# EAGLE design Ver.5 IR (EAGLE 9.6.2)
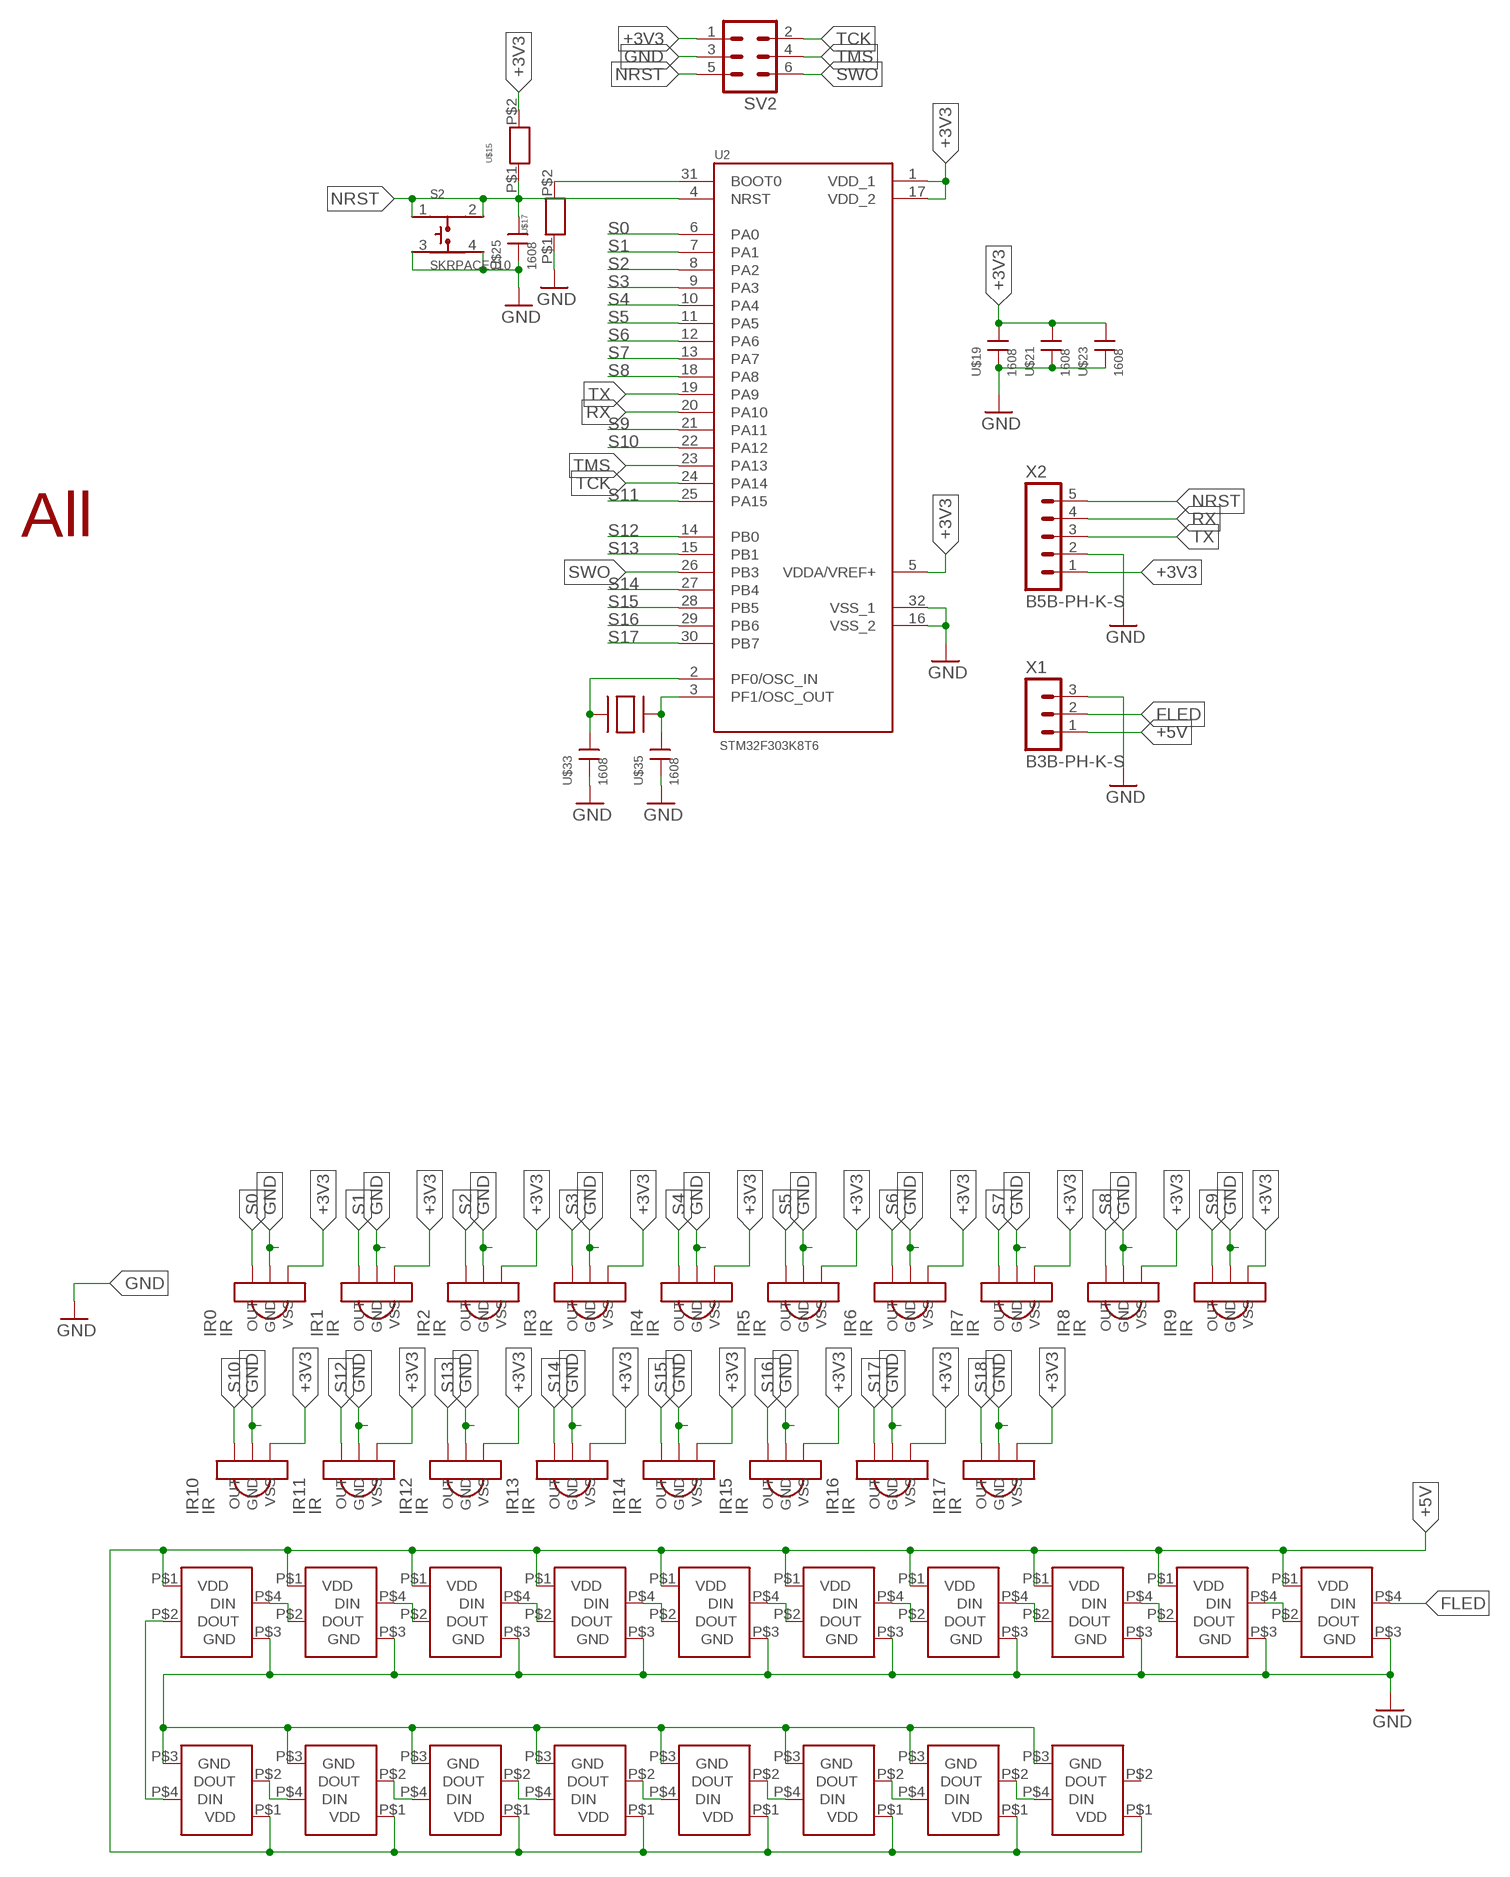
[diagram p0: schematic, sheet 1]

## Parts
F0  LED  [LED]
F1  LED  [LED]
F2  LED  [LED]
F3  LED  [LED]
F4  LED  [LED]
F5  LED  [LED]
F6  LED  [LED]
F7  LED  [LED]
F8  LED  [LED]
F9  LED  [LED]
F10  LED  [LED]
F11  LED  [LED]
F12  LED  [LED]
F13  LED  [LED]
F14  LED  [LED]
F15  LED  [LED]
F16  LED  [LED]
F17  LED  [LED]
IR0  IR  [IR]
IR1  IR  [IR]
IR2  IR  [IR]
IR3  IR  [IR]
IR4  IR  [IR]
IR5  IR  [IR]
IR6  IR  [IR]
IR7  IR  [IR]
IR8  IR  [IR]
IR9  IR  [IR]
IR10  IR  [IR]
IR11  IR  [IR]
IR12  IR  [IR]
IR13  IR  [IR]
IR14  IR  [IR]
IR15  IR  [IR]
IR16  IR  [IR]
IR17  IR  [IR]
S2  SKRPACE010  [SW_SKRPACE010]
SV2  ML6  [ML6]
U2  STM32F303K8T6  [QFP80P900X900X160-32N]
U$1  ALL  [ALL]
U$15  R  [1608]
U$17  R  [1608]
U$19  1608  [CON]
U$21  1608  [CON]
U$23  1608  [CON]
U$25  1608  [CON]
U$27  SUISYOU  [水晶]
U$33  1608  [CON]
U$35  1608  [CON]
X1  B3B-PH-K-S  [B3B-PH-K-S]
X2  B5B-PH-K-S  [B5B-PH-K-S]

## Nets
+3V3 [New Class]: IR0.P$3(VSS) IR1.P$3(VSS) IR2.P$3(VSS) IR3.P$3(VSS) IR4.P$3(VSS) IR5.P$3(VSS) IR6.P$3(VSS) IR7.P$3(VSS) IR8.P$3(VSS) IR9.P$3(VSS) IR10.P$3(VSS) IR11.P$3(VSS) IR12.P$3(VSS) IR13.P$3(VSS) IR14.P$3(VSS) IR15.P$3(VSS) IR16.P$3(VSS) IR17.P$3(VSS) SV2.1 U2.1(VDD_1) U2.5(VDDA/VREF+) U2.17(VDD_2) U$15.P$2 U$19.P$1 U$21.P$1 U$23.P$1 X2.1
+5V [New Class]: F0.P$1(VDD) F1.P$1(VDD) F2.P$1(VDD) F3.P$1(VDD) F4.P$1(VDD) F5.P$1(VDD) F6.P$1(VDD) F7.P$1(VDD) F8.P$1(VDD) F9.P$1(VDD) F10.P$1(VDD) F11.P$1(VDD) F12.P$1(VDD) F13.P$1(VDD) F14.P$1(VDD) F15.P$1(VDD) F16.P$1(VDD) F17.P$1(VDD) X1.1
FLED: F0.P$4(DIN) X1.2
GND [New Class]: F0.P$3(GND) F1.P$3(GND) F2.P$3(GND) F3.P$3(GND) F4.P$3(GND) F5.P$3(GND) F6.P$3(GND) F7.P$3(GND) F8.P$3(GND) F9.P$3(GND) F10.P$3(GND) F11.P$3(GND) F12.P$3(GND) F13.P$3(GND) F14.P$3(GND) F15.P$3(GND) F16.P$3(GND) F17.P$3(GND) IR0.P$2(GND) IR1.P$2(GND) IR2.P$2(GND) IR3.P$2(GND) IR4.P$2(GND) IR5.P$2(GND) IR6.P$2(GND) IR7.P$2(GND) IR8.P$2(GND) IR9.P$2(GND) IR10.P$2(GND) IR11.P$2(GND) IR12.P$2(GND) IR13.P$2(GND) IR14.P$2(GND) IR15.P$2(GND) IR16.P$2(GND) IR17.P$2(GND) S2.3 S2.4 SV2.3 U2.16(VSS_2) U2.32(VSS_1) U$17.P$1 U$19.P$2 U$21.P$2 U$23.P$2 U$25.P$2 U$33.P$2 U$35.P$2 X1.3 X2.2
N$1: F14.P$2(DOUT) F15.P$4(DIN)
N$2: F13.P$2(DOUT) F14.P$4(DIN)
N$3: F11.P$2(DOUT) F12.P$4(DIN)
N$4: F10.P$2(DOUT) F11.P$4(DIN)
N$5: F8.P$2(DOUT) F9.P$4(DIN)
N$6: F7.P$2(DOUT) F8.P$4(DIN)
N$7: F5.P$2(DOUT) F6.P$4(DIN)
N$8: F4.P$2(DOUT) F5.P$4(DIN)
N$9: F2.P$2(DOUT) F3.P$4(DIN)
N$10: F1.P$2(DOUT) F2.P$4(DIN)
N$11: F0.P$2(DOUT) F1.P$4(DIN)
N$12: F3.P$2(DOUT) F4.P$4(DIN)
N$13: F6.P$2(DOUT) F7.P$4(DIN)
N$14: F9.P$2(DOUT) F10.P$4(DIN)
N$15: F16.P$2(DOUT) F17.P$4(DIN)
N$17: F15.P$2(DOUT) F16.P$4(DIN)
N$18: F12.P$2(DOUT) F13.P$4(DIN)
N$38: U2.31(BOOT0) U$17.P$2
N$39: U2.2(PF0/OSC_IN) U$27.P$1 U$33.P$1
N$40: U2.3(PF1/OSC_OUT) U$27.P$2 U$35.P$1
NRST: S2.1 S2.2 SV2.5 U2.4(NRST) U$15.P$1 U$25.P$1 X2.5
RX: U2.20(PA10) X2.4
S0: IR0.P$1(OUT) U2.6(PA0)
S1: IR1.P$1(OUT) U2.7(PA1)
S2: IR2.P$1(OUT) U2.8(PA2)
S3: IR3.P$1(OUT) U2.9(PA3)
S4: IR4.P$1(OUT) U2.10(PA4)
S5: IR5.P$1(OUT) U2.11(PA5)
S6: IR6.P$1(OUT) U2.12(PA6)
S7: IR7.P$1(OUT) U2.13(PA7)
S8: IR8.P$1(OUT) U2.18(PA8)
S9: IR9.P$1(OUT) U2.21(PA11)
S10: IR10.P$1(OUT) U2.22(PA12)
S11: U2.25(PA15)
S12: IR11.P$1(OUT) U2.14(PB0)
S13: IR12.P$1(OUT) U2.15(PB1)
S14: IR13.P$1(OUT) U2.27(PB4)
S15: IR14.P$1(OUT) U2.28(PB5)
S16: IR15.P$1(OUT) U2.29(PB6)
S17: IR16.P$1(OUT) U2.30(PB7)
S18: IR17.P$1(OUT)
SWO: SV2.6 U2.26(PB3)
TCK: SV2.2 U2.24(PA14)
TMS: SV2.4 U2.23(PA13)
TX: U2.19(PA9) X2.3
Unconnected: F17.P$2(DOUT)

## Library data of the parts
F0 F1-F17 = フルカラーLED:LED
IR0 IR1-IR17 = IR:IR
S2 = SKRPACE010:SKRPACE010: Switch Tactile N.O. SPST Button J-Bend 0.05A 16VDC 2.55N SMD Automotive T/R Check prices <https://pricing.snapeda.com/parts/SKRPACE010/ALPS/view-part?ref=eda>; AVAILABILITY: In Stock; DESCRIPTION: Switch Tactile N.O. SPST Button J-Bend 0.05A 16VDC 2.55N SMD Automotive T/R; MF: ALPS; MP: SKRPACE010; PACKAGE: None; PRICE: None
SV2 = con-ml:ML6: HARTING; OC_FARNELL: unknown; OC_NEWARK: unknown
U2 = STM32F303K8T6:STM32F303K8T6: Analog and DSP with FPU ARM Cortex-M4 MCU with 64 Kbytes Flash, 72 MHz CPU, CCM, 12-bit ADC 5 MSPS, comparators, op-amp Check availability <https://pricing.snapeda.com/parts/STM32F303K8T6/STMicroelectronics/view-part?ref=eda>; AVAILABILITY: In Stock; DESCRIPTION: ARM® Cortex®-M4 STM32F3 Microcontroller IC 32-Bit 72MHz 64KB (64K x 8) FLASH 32-LQFP (7x7); MF: STMicroelectronics; MP: STM32F303K8T6; PACKAGE: LQFP-32 STMicroelectronics; PRICE: None; PURCHASE-URL: https://pricing.snapeda.com/search/part/STM32F303K8T6/?ref=eda
U$1 = All_outlook:ALL
U$15 U$17 = R 1608:R
U$19 U$21 U$23 U$25 U$33 U$35 = con1608:1608
U$27 = 水晶:SUISYOU
X1 = con-JST PH:B3B-PH: JST PH series header 2.00mm pitch disconnectable crimp style connectors, vertical (side entry type), 3 pins
X2 = con-JST PH:B5B-PH: JST PH series header 2.00mm pitch disconnectable crimp style connectors, vertical (side entry type), 5 pins

## Net classes
1 New Class: width 0.254 mm

## Board
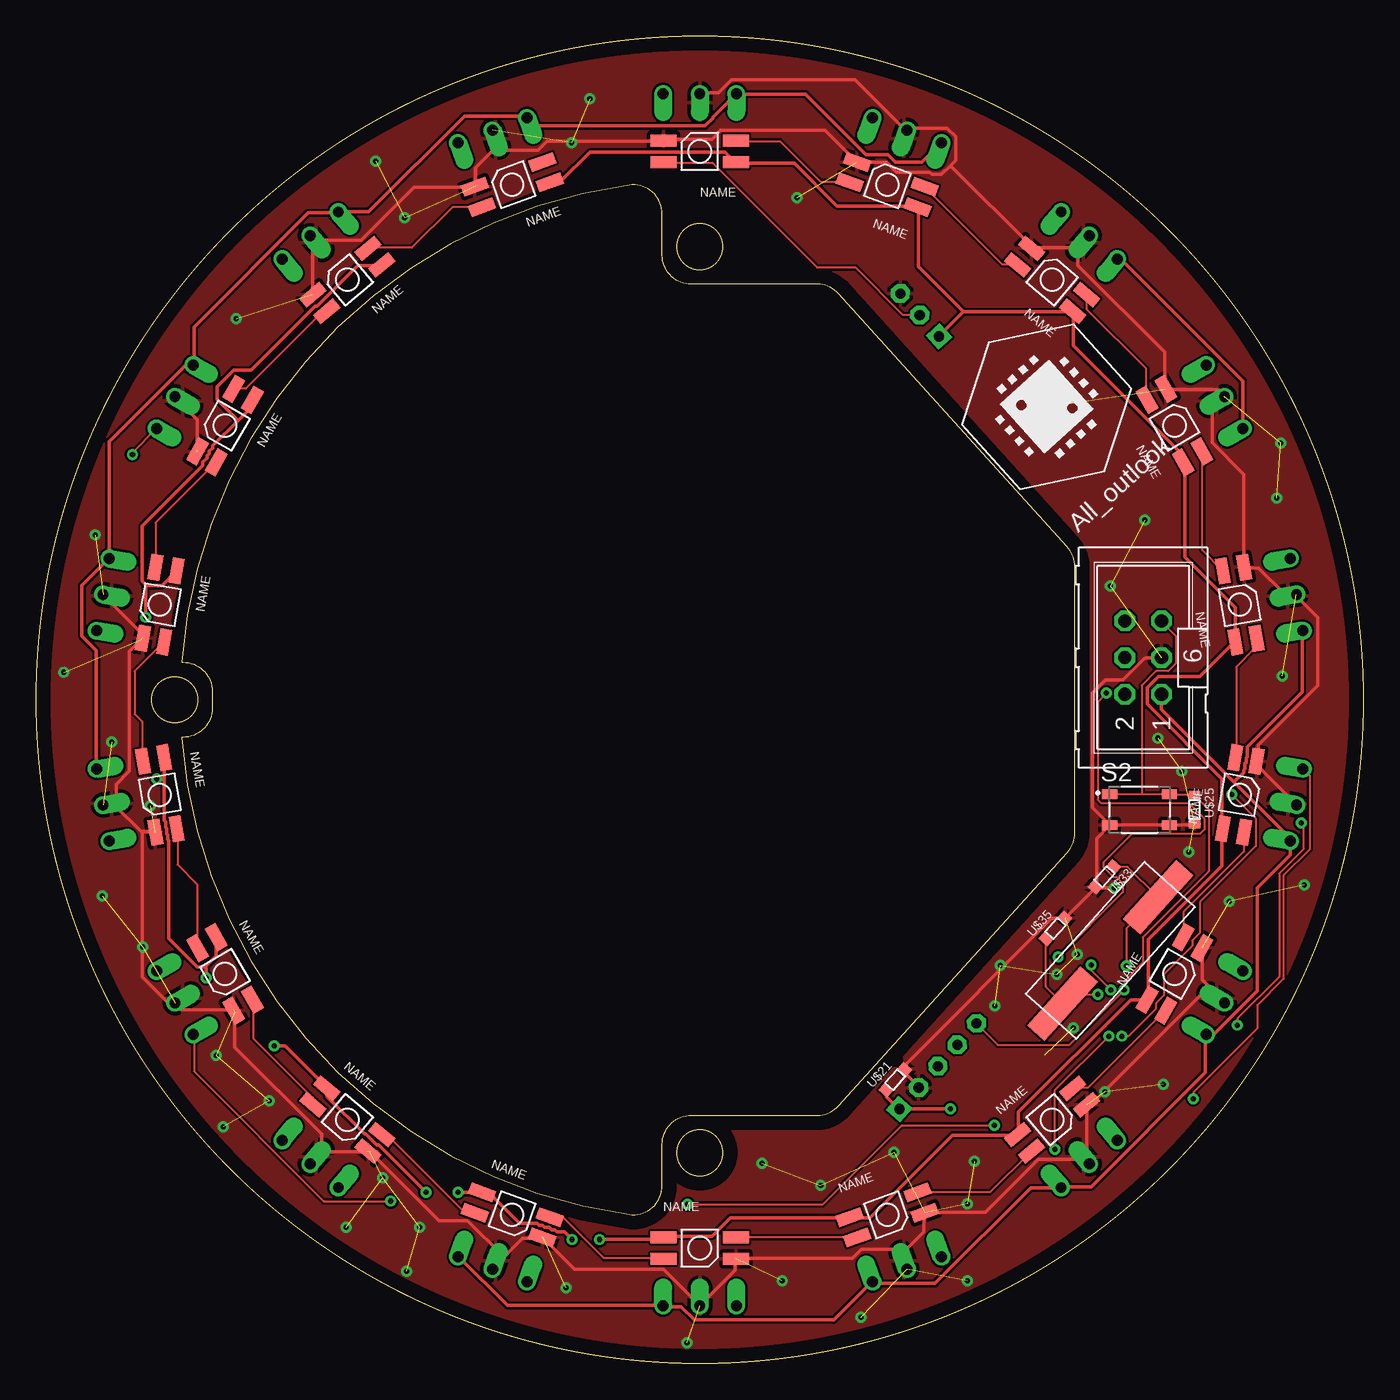
[diagram p1: board, top side]
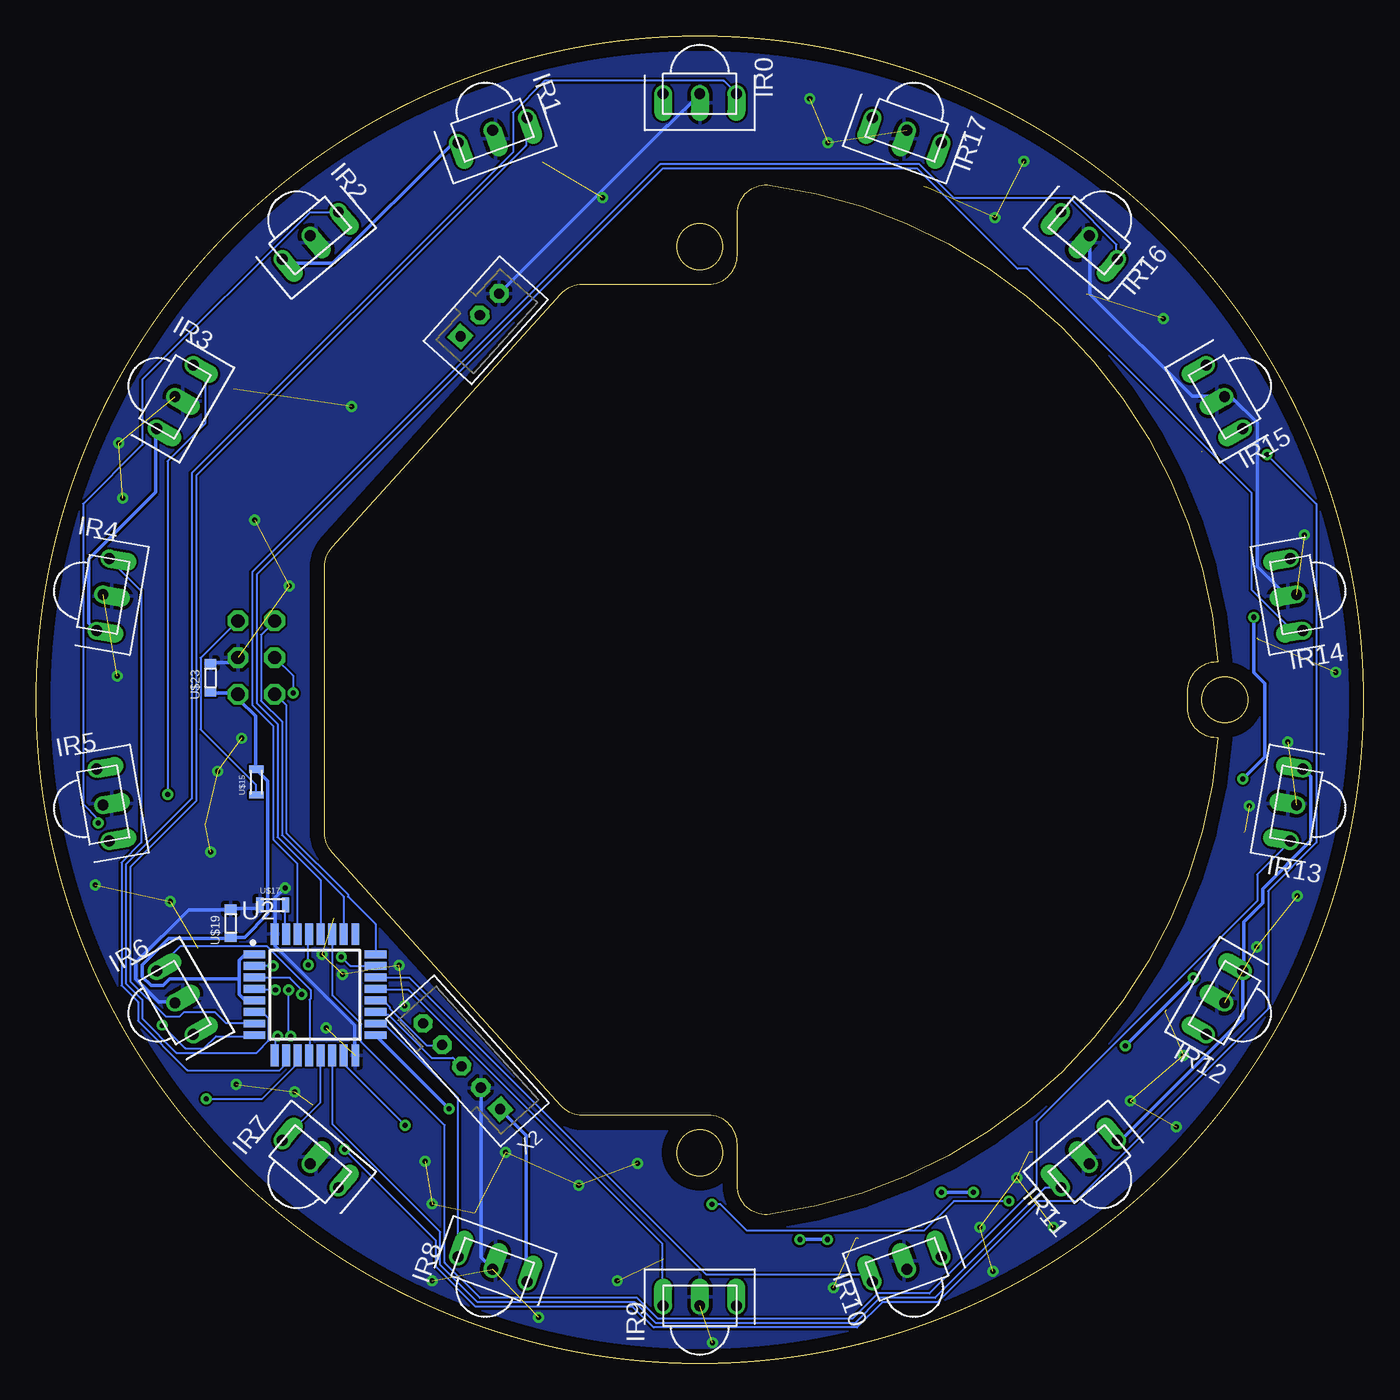
[diagram p2: board, bottom side, seen from below]

Size 92 x 92 mm. Coordinates in mm from the lower left corner, seen from the top.
Outline: 55.61,17.86 71.48,35.42 arc42 72,36.76 72,55.24 arc42 71.48,56.58 55.61,74.14 arc48 54.13,74.8 45.4,74.8 arc-90 43.4,76.8 43.4,79.69 arc98 41.13,81.67 arc78 10.1,48.63 arc94 10.13,48.6 10.2,48.6 arc-90 12.2,46.6 12.2,45.4 arc-90 10.2,43.4 10.15,43.4 arc94 10.1,43.35 arc78 41.13,10.33 arc98 43.4,12.31 43.4,15.2 arc-90 45.4,17.2 54.13,17.2 arc48 55.61,17.86
Outline: circle at 46,14.6 radius 1.6
Outline: circle at 46,77.4 radius 1.6
Outline: circle at 46,46 radius 46
Outline: circle at 9.6,46 radius 1.6
Copper layers (1*16): Top 0.035mm / dielectric 1.5mm / Bottom 0.035mm
Design rules "default": minimum track width 6mil, minimum drill 0.35mm, track to track 6mil, track to pad 6mil, pad to pad 6mil, via to via 6mil, smd to smd 6mil, copper to edge 40mil, drill to drill 6mil, minimum pad ring 10mil, minimum via ring 8mil, stop-mask expansion 4mil, vias tented up to drill 0mil, thermal gap 10mil

### Footprints (pad centres in the part's own frame; a part is rotated, then mirrored left to right if it is on the bottom)
LED = smd 1.8 x 0.82: P$1 -2.5,0.75; P$2 -2.5,-0.75; P$3 2.5,-0.75; P$4 2.5,0.75
IR = drill 0.75 offset: P$1 -2.54,0; P$2 0,0; P$3 2.54,0
SW_SKRPACE010 = smd 1.05 x 0.65: 1 -2.075,1.075; 2 2.075,1.075; 3 -2.075,-1.075; 4 2.075,-1.075
ML6 = drill 0.914 octagon: 1 -2.54,-1.27; 2 -2.54,1.27; 3 0,-1.27; 4 0,1.27; 5 2.54,-1.27; 6 2.54,1.27
QFP80P900X900X160-32N = smd 1.5 x 0.55: 1 -4.2,2.8; 2 -4.2,2; 3 -4.2,1.2; 4 -4.2,0.4; 5 -4.2,-0.4; 6 -4.2,-1.2; 7 -4.2,-2; 8 -4.2,-2.8; 17 4.2,-2.8; 18 4.2,-2; 19 4.2,-1.2; 20 4.2,-0.4; 21 4.2,0.4; 22 4.2,1.2; 23 4.2,2; 24 4.2,2.8 | smd 0.55 x 1.5: 9 -2.8,-4.2; 10 -2,-4.2; 11 -1.2,-4.2; 12 -0.4,-4.2; 13 0.4,-4.2; 14 1.2,-4.2; 15 2,-4.2; 16 2.8,-4.2; 25 2.8,4.2; 26 2,4.2; 27 1.2,4.2; 28 0.4,4.2; 29 -0.4,4.2; 30 -1.2,4.2; 31 -2,4.2; 32 -2.8,4.2
1608 = smd 0.508 x 1.016: P$1 -0.889,0; P$2 0.889,0
CON = smd 0.6 x 0.813: P$1 -1,0; P$2 1,0
水晶 = smd 5.5 x 1.6: P$1 1.2,2.35; P$2 11.1,2.35
B3B-PH-K-S = drill 0.7 pad 1.3 square: 1 2,0 | drill 0.7 pad 1.3 octagon: 2 0,0; 3 -2,0
B5B-PH-K-S = drill 0.7 pad 1.3 square: 1 4,0 | drill 0.7 pad 1.3 octagon: 2 2,0; 3 0,0; 4 -2,0; 5 -4,0

### Placement (x,y rotation side)
F0  46,84 180 top
F1  59,81.71 160 top
F2  70.42,75.11 140 top
F3  78.91,65 120 top
F4  83.42,52.6 100 top
F5  83.42,39.4 80 top
F6  78.91,27 60 top
F7  70.42,16.89 40 top
F8  59,10.29 20 top
F9  46,8 0 top
F10  33,10.29 340 top
F11  21.57,16.89 320 top
F12  13.09,27 300 top
F13  8.58,39.4 280 top
F14  8.58,52.6 260 top
F15  13.09,65 240 top
F16  21.57,75.11 220 top
F17  33,81.71 200 top
IR0  46,88 180 bottom
IR1  60.36,85.47 200 bottom
IR2  73,78.17 220 bottom
IR3  82.37,67 240 bottom
IR4  87.36,53.29 260 bottom
IR5  87.36,38.71 280 bottom
IR6  82.37,25 300 bottom
IR7  73,13.83 320 bottom
IR8  60.36,6.53 340 bottom
IR9  46,4 0 bottom
IR10  31.64,6.53 20 bottom
IR11  19,13.83 40 bottom
IR12  9.63,25 60 bottom
IR13  4.64,38.71 80 bottom
IR14  4.64,53.29 100 bottom
IR15  9.63,67 120 bottom
IR16  19,78.17 140 bottom
IR17  31.64,85.47 160 bottom
S2  76.48,38.38 0 top
SV2  76.73,48.92 90 top
U2  72.67,25.55 0 bottom
U$1  70.04,66.32 42 top
U$15  76.73,40.28 90 bottom
U$17  75.59,31.78 0 bottom
U$19  78.51,30.51 90 bottom
U$21  59.56,19.67 48 top
U$23  79.91,47.52 90 bottom
U$25  80.29,38.38 270 top
U$27  76.83,34.77 228 top
U$33  74.05,33.73 228 top
U$35  70.66,30.15 48 top
X1  61.24,72.67 228 bottom
X2  62.51,20.6 312 bottom

### Tracks (layer width: path | path; a pad name or v marks a point on that pad's centre or on a via)
+3V3  (via drill 0.35)
  Top 0.254: IR13.P$3 4.17,41.28 4.17,49.43 3.18,50.42 3.18,53.92 5,55.75 IR14.P$3 5.08,55.91 5.08,63.91 10.34,69.16 10.87,69.16 IR15.P$3 10.95,69.32 10.95,71.83 18.87,79.76 20.85,79.76 IR16.P$3 21.01,79.83 23.06,79.83 29.69,86.46 33.88,86.46 33.96,86.39 IR17.P$3 34.11,86.31 34.65,85.78 46.38,85.78 46.91,86.31 46.91,86.39 48.52,87.99 IR0.P$3 48.67,87.99 53.31,87.99 57.51,83.8 59.03,83.8 59.56,83.26 61.39,83.26 62.69,84.56 IR1.P$3 | IR2.P$3 74.96,76.48 75.26,76.48 83.64,68.1 83.64,64.82 IR3.P$3 | 83.03,40.28 78,45.31 SV2.1 | 83.03,40.28 86.92,36.4 86.92,36.25 IR5.P$3 86.92,36.09 86.92,35.26 84.63,32.97 84.63,25.81 81.66,22.84 81.2,22.84 IR6.P$3 81.05,22.76 81.05,20.17 73.13,12.24 71.15,12.24 IR7.P$3 70.99,12.17 68.94,12.17 62.31,5.54 58.12,5.54 58.04,5.61 IR8.P$3 57.89,5.61 55.3,3.02 45.62,3.02 44.7,3.94 43.56,3.94 IR9.P$3 43.41,4.01 32.66,4.01 29.31,7.37 IR10.P$3 | 83.03,40.28 83.72,40.97 83.72,41.12 83.8,41.2 83.8,41.58 83.87,41.66 83.87,41.96 83.95,42.04 83.95,42.72 87.76,46.53 87.76,50.72 IR4.P$3 | U$21.P$1 58.95,18.87 58.95,18.49 59.79,17.65 X2.1 59.95,17.65 v63.37,17.65
  Bottom 0.254: IR11.P$3 17.04,15.52 16.74,15.52 8.36,23.9 8.36,27.18 IR12.P$3 8.28,27.25 8.28,30.61 6.99,31.9 6.99,32.89 3.63,36.25 3.63,40.67 4.17,41.2 IR13.P$3 | IR1.P$3 62.76,84.56 63.14,84.56 71.45,76.25 74.65,76.25 74.88,76.48 IR2.P$3 | 77.93,26.64 77.93,27.94 77.55,28.32 76.94,28.32 U2.1 | 77.93,26.64 77.93,25.58 77.55,25.2 76.94,25.2 U2.5 | 77.93,26.64 82.73,26.64 83.19,26.19 84.02,26.19 84.63,26.8 84.63,27.64 82.81,29.46 78.61,29.46 U$19.P$1 78.46,29.54 77.55,29.54 75.95,31.14 75.95,40.36 76.71,41.12 U$15.P$2 76.78,41.28 76.78,44.86 77.93,46 77.93,46.3 SV2.1 78.08,46.46 79.91,46.46 U$23.P$1 | v63.37,17.65 68.4,22.68 U2.17 | IR8.P$3 58.04,5.69 58.04,15.82 59.79,17.58 X2.1 | IR3.P$3 83.72,64.75 83.72,60.4 88.37,55.75 88.37,51.33 87.83,50.8 IR4.P$3
+5V  (via drill 0.35)
  Top 0.254: 7.67,53.92 8.74,53.92 9.73,54.91 F14.P$1 | 7.67,53.92 7.37,54.23 7.37,58.04 11.56,62.23 11.56,62.46 11.86,62.76 11.86,62.92 12.02,63.07 12.02,63.22 12.24,63.45 12.24,63.6 14,65.36 | 14,65.36 14.76,66.12 14.76,66.5 14.99,66.73 F15.P$1 | 14,65.36 12.55,66.8 12.55,67.72 13.69,68.86 14.91,68.86 19.33,73.28 19.48,73.28 22.3,76.1 23.9,76.1 F16.P$1 | 11.71,27.48 12.47,28.25 12.47,29.46 F12.P$1 | 11.71,27.48 11.18,27.48 9.2,29.46 9.2,36.25 9.12,36.32 9.12,36.63 9.04,36.7 9.04,37.09 8.97,37.16 8.97,37.54 8.89,37.62 8.89,40.51 | 8.89,40.51 8.89,41.96 F13.P$1 | v29.24,11.86 30.84,11.86 F10.P$1 30.99,11.79 31.45,11.79 33.5,9.73 34.72,9.73 34.88,9.58 35.1,9.58 35.26,9.42 35.56,9.42 35.71,9.27 35.94,9.27 36.09,9.12 36.63,9.12 v37.16,8.59 | v27.03,11.86 23.75,15.14 23.6,15.14 22.84,15.9 22.76,15.9 20.17,18.49 20.17,19.02 F11.P$1 20.09,19.18 17.27,22 v16.51,22 | v11.79,26.72 11.79,27.41 11.71,27.48 | v7.59,51.72 7.59,53.85 7.67,53.92 | 8.89,40.51 v8.36,40.51 | F17.P$1 35.64,81.89 36.32,81.89 38.38,83.95 47.75,83.95 48.44,83.26 F0.P$1 48.59,83.19 52.55,83.19 55.52,80.21 61.01,80.21 F1.P$1 61.16,80.14 61.16,76.02 64.29,72.9 | 64.29,72.9 71.83,72.9 F2.P$1 71.91,72.82 71.91,70.54 79.45,62.99 79.45,62.53 F3.P$1 79.6,62.38 79.6,55.91 83.11,52.4 83.11,50.04 F4.P$1 83.03,49.96 80.67,47.6 77.78,47.6 77.01,46.84 77.01,45.7 82.19,40.51 82.19,37.16 F5.P$1 82.19,37.01 82.19,34.49 77.09,29.39 77.09,25.27 F6.P$1 76.94,25.2 75.87,25.2 68.1,17.43 68.1,15.9 F7.P$1 67.95,15.82 63.53,15.82 57.81,10.11 56.52,10.11 F8.P$1 56.36,10.11 48.13,10.11 46.84,8.81 44.07,8.81 44.01,8.75 F9.P$1 43.41,8.66 42.9,8.66 42.83,8.59 v39.07,8.59
  Top 0.254: 64.29,72.9 62.61,71.22 X1.1
  Bottom 0.254: v27.03,11.86 v29.24,11.86 | v16.51,22 v11.79,26.72 | v7.59,51.72 7.59,47.91 6.83,47.14 6.83,42.04 v8.36,40.51 | v39.07,8.59 v37.16,8.59
FLED
  Top 0.152: X1.2 60.1,72.67 56.82,75.95 54.15,75.95 46.91,83.19 43.56,83.19 F0.P$4
GND  (via drill 0.35)  (60 unrouted)
  Top 0.254: 19.18,74.12 19.18,78 19.02,78.16 IR16.P$2 19.25,77.85 22.53,77.85 26.19,81.51 30.3,81.51 | 30.45,81.59 30.45,82.88 31.6,84.02 31.6,85.4 IR17.P$2 31.67,84.1 34.8,84.1 35.41,84.71 43.48,84.71 F0.P$3 43.56,84.86 46.84,84.86 47.45,85.47 54.69,85.47 56.82,83.34 F1.P$3 56.97,83.26 58.95,83.26 59.64,82.58 61.93,82.58 62.08,82.42 62.76,82.42 63.37,83.03 | 63.37,83.03 63.75,83.41 63.75,85.01 63.14,85.62 60.55,85.62 60.4,85.47 IR1.P$2 60.25,85.47 56.74,88.98 48.21,88.98 47.3,88.06 46,88.06 IR0.P$2 | IR5.P$2 87.3,38.76 84.63,41.43 84.63,41.73 F5.P$3 84.71,41.81 84.71,42.88 88.82,46.99 88.82,51.72 87.38,53.16 IR4.P$2 87.3,53.31 86.54,53.31 84.71,55.14 83.8,55.14 F4.P$3 83.72,55.3 83.72,61.62 81.51,63.83 81.51,66.04 82.35,66.88 IR3.P$2 82.35,67.03 81.89,67.49 78.31,67.49 F3.P$3 78.23,67.64 78.23,70.08 72.21,76.1 72.21,77.24 IR2.P$2 72.97,78.16 72.14,77.32 69.01,77.32 F2.P$3 69.01,77.39 63.37,83.03 | U$33.P$2 73.43,32.97 71.38,30.91 U$35.P$2 71.22,30.84 70.38,30.84 60.33,20.78 60.33,20.47 U$21.P$2 60.25,20.4 60.25,20.09 61.16,19.18 X2.2 | U$25.P$2 80.29,37.31 78.61,37.31 S2.4 78.46,37.31 74.42,37.31 S2.3 | U$33.P$2 73.51,33.05 73.51,36.4 74.35,37.24 S2.3 | SV2.3 78,48.9 76.86,48.9 75.34,47.37 74.12,47.37 73.2,46.46 73.2,38.53 74.35,37.39 S2.3 | v74.73,32.97 73.58,32.97 U$33.P$2 | F6.P$3 80.82,28.78 80.82,26.57 82.35,25.05 IR6.P$2 81.2,26.04 73.13,17.96 72.9,17.96 F7.P$3 72.82,17.88 72.82,14 72.97,13.84 IR7.P$2 72.75,14.15 69.47,14.15 65.81,10.49 61.7,10.49 F8.P$3 61.55,10.41 61.55,9.12 60.4,7.98 60.4,6.6 IR8.P$2 60.33,7.9 57.2,7.9 56.59,7.29 48.59,7.29 F9.P$3 48.44,7.21 48.44,6.45 46,4.01 IR9.P$2 45.92,4.09 43.48,6.53 37.31,6.53 35.18,8.66
  Top 0.254: 7.37,36.86 7.29,36.86 5.46,38.69 4.7,38.69 IR13.P$2 5.54,38.76 5.54,40.13 6.45,41.05 6.45,49.35 7.29,50.19 | 7.37,36.86 8.2,36.86 | 11.18,63.22 11.18,65.43 9.65,66.95 IR15.P$2 | 7.37,50.27 7.37,50.57 4.7,53.24 IR14.P$2 | 35.03,8.66 33.73,8.66 31.67,6.6 IR10.P$2 32.36,7.44 29.92,9.88 27.94,9.88 23.14,14.68 | 13.69,24.51 10.11,24.51 9.65,24.97 IR12.P$2 9.5,24.97 9.2,24.97 7.37,26.8 7.37,36.86 | 22.99,14.68 19.86,14.68 19.02,13.84 IR11.P$2 19.79,14.76 19.79,15.9 13.77,21.92 13.77,24.36
  Bottom 0.254: X1.3 59.87,74.19 48.29,85.78 48.21,85.78 46,87.99 IR0.P$2 | U2.16 69.93,21.39 69.93,23.45 75.41,28.93 75.41,29.69 U2.32 75.41,29.85 75.41,32.28 v74.73,32.97 | U$23.P$2 79.91,48.59 78.31,48.59 78,48.9 SV2.3 | U$17.P$1 76.48,31.75 76.71,31.52 78.46,31.52 U$19.P$2 78.61,31.45 81.43,31.45 85.09,27.79 85.09,26.64 83.49,25.05 82.42,25.05 IR6.P$2 | X2.2 61.16,7.37 60.4,6.6 IR8.P$2 | IR14.P$2 4.7,53.31 5.46,53.31 7.37,55.22 7.37,65.2 9.12,66.95 9.58,66.95 IR15.P$2 9.73,67.03 11.86,67.03 18.95,74.12 18.95,78.16 IR16.P$2
  other vias: 70.13,66.32 52.73,80.8 38.38,87.66 37.11,84.61 25.55,79.4 23.52,83.34 13.87,72.42 4.09,57.43 1.93,47.91 5.23,43.08 7.9,38.63 4.6,32.41 7.39,28.86 12.47,21.36 12.98,16.41 16.16,18.19 21.49,9.42 24.03,12.85 26.57,9.42 25.68,6.38 36.73,5.23 45.11,1.42 50.32,13.87 54.38,12.34 51.72,5.74 57.18,3.2 64.54,5.74 64.54,11.08 65.05,14 59.46,14.63 74.07,18.82 78.13,19.33 71.91,23.27 72.16,28.35 66.83,27.59 66.45,24.79 70.77,26.95 87.91,33.17 82.7,32.03 79.91,35.46 86,59.97 86.26,63.78 76.86,58.45 74.45,53.87 86.39,47.65 79.4,41.05 77.75,43.33
  pour Top: -13.69,90.45 -13.69,-2.26 96.8,-2.26 96.8,94.26 -9.88,94.26 -13.69,94.26
  pour Bottom: -3.53,86.64 -3.53,-3.53 106.96,-3.53 106.96,91.72 -0.99,91.72 -3.53,91.72
N$1
  Top 0.152: F14.P$2 8.28,55.22 8.28,58.27 12.47,62.46 F15.P$4
N$2
  Top 0.152: F13.P$2 7.37,41.81 7.37,44.48 6.83,45.01 6.83,47.98 8.81,49.96 F14.P$4
N$3
  Top 0.152: F11.P$2 19.18,17.96 19.18,18.42 15.06,22.53 15.06,25.2 F12.P$4
N$4
  Top 0.152: F11.P$4 23.98,15.82 24.36,15.82 29.69,10.49 30.38,10.49 F10.P$2
N$5
  Top 0.152: F9.P$4 48.52,8.74 F8.P$2
N$6
  Top 0.152: F8.P$4 61.16,11.86 66.12,11.86 68.94,14.68 F7.P$2
N$7
  Top 0.152: F6.P$4 79.53,29.54 79.53,31.29 83.72,35.48 83.72,36.78 F5.P$2
N$8
  Top 0.152: F5.P$4 83.19,42.04 83.19,48.29 84.56,49.66 84.56,50.19 F4.P$2
N$9
  Top 0.152: F2.P$2 72.82,74.04 72.82,73.05 76.94,68.94 76.94,66.8 F3.P$4
N$10
  Top 0.152: F2.P$4 68.02,76.17 66.95,76.17 61.62,81.51 F1.P$2
N$11
  Top 0.152: F1.P$4 56.36,81.89 54.38,81.89 51.56,84.71 48.52,84.71 F0.P$2
N$12
  Top 0.152: F3.P$2 80.82,63.14 80.82,56.36 82.19,54.99 F4.P$4
N$13
  Top 0.152: F7.P$4 71.91,19.1 72.9,19.1 78.23,24.43 F6.P$2
N$14
  Top 0.152: F10.P$4 35.64,10.11 36.55,10.11 39.37,7.29 43.48,7.29 F9.P$2
N$15
  Top 0.152: F16.P$2 23.06,77.32 26.04,77.32 28.86,80.14 30.84,80.14 F17.P$4
N$17
  Top 0.152: F15.P$2 13.77,67.56 14.53,67.56 19.86,72.9 20.09,72.9 F16.P$4
N$18
  Top 0.152: F12.P$2 11.18,28.86 11.18,33.2 9.8,34.57 9.8,37.01 F13.P$4
N$38
  Bottom 0.152: U$17.P$2 74.73,31.75 74.73,29.77 U2.31
N$39  (via drill 0.35)
  Top 0.152: U$33.P$1 74.73,34.42 75.64,34.42 77.7,32.36 U$27.P$1 77.7,32.28 75.57,30.15 v75.57,27.56
  Bottom 0.152: v75.57,27.56 U2.2
N$40  (via drill 0.35)
  Top 0.152: U$35.P$1 70,29.39 70,26.11 71.15,24.97 U$27.P$2 71.22,24.97 71.83,25.58 v73.58,25.58
  Bottom 0.152: v73.58,25.58 73.58,25.88 74.42,26.72 76.86,26.72 U2.3
NRST  (via drill 0.35)
  Top 0.152: X2.5 65.2,23.52 66.65,22.07 71.6,22.07 v75.41,25.88 75.41,26.49 76.71,27.79 76.71,29.54 81.28,34.11 81.28,38.38 U$25.P$1 80.29,39.45 78.61,39.45 S2.2 78.54,39.45 76.63,39.45 | 76.63,39.45 74.42,39.45 S2.1 | 76.63,39.45 76.63,46.99 77.62,47.98 78.46,47.98 79,48.52 79,50.42 78,51.41 SV2.5
  Bottom 0.152: v75.41,25.88 76.86,25.88 U2.4 | U$15.P$1 76.78,39.45 76.78,40.13 80.59,43.94 80.59,48.9 78,51.49 SV2.5
RX
  Bottom 0.152: U2.20 68.43,25.11 67.88,25.11 67.48,24.71 67.48,24.6 64.92,22.04 63.89,22.04 X2.4
S0
  Bottom 0.152: U2.6 76.86,24.28 76.25,24.28 75.87,23.9 75.87,22.38 76.71,21.54 82.27,21.54 84.63,23.9 84.63,25.2 85.78,26.34 85.78,34.57 81.2,39.14 81.2,61.7 58.95,83.95 58.95,86.69 56.74,88.9 44.32,88.9 43.48,88.06 IR0.P$1
S1
  Bottom 0.152: U2.7 76.94,23.6 78.84,23.6 79.6,24.36 81.74,24.36 82.04,24.05 83.03,24.05 85.47,26.49 85.47,34.42 80.9,38.99 80.9,61.55 58.04,84.41 58.04,86.31 IR1.P$1
S2  (via drill 0.35)
  Top 0.152: v83.26,23.45 83.26,23.9 86.16,26.8 86.16,33.96 87.83,35.64 87.83,37.31 v87.68,37.47
  Bottom 0.152: v83.26,23.45 81.66,21.84 80.37,21.84 79.53,22.68 76.94,22.68 U2.8 | v87.68,37.47 87.68,37.69 88.75,38.76 88.75,59.56 84.63,63.68 84.63,68.17 73.05,79.76 71.07,79.76 IR2.P$1
S3  (via drill 0.35)
  Top 0.152: v75.26,22.68 75.72,22.68 77.62,24.59 77.62,24.97 78.16,25.5 78.16,26.95 80.14,28.93 80.14,29.31 80.67,29.85 80.67,31.98 84.56,35.87 84.56,37.77 v82.88,39.45
  Bottom 0.152: v75.26,22.68 75.41,22.53 75.41,21.39 U2.9 | v82.88,39.45 82.88,62.53 80.29,65.13 80.29,68.4 81.05,69.16 IR3.P$1
S4
  Bottom 0.152: U2.10 74.73,21.31 74.73,20.7 75.11,20.32 81.51,20.32 84.94,23.75 84.94,25.05 86.08,26.19 86.08,34.72 84.71,36.09 84.71,53.54 86.92,55.75 IR4.P$1
S5  (via drill 0.35)
  Top 0.152: v80.21,18.34 80.21,18.8 84.63,23.22 84.63,24.82 86.46,26.64 86.46,33.81 88.29,35.64 88.29,40.74 87.83,41.2 IR5.P$1
  Bottom 0.152: v80.21,18.34 76.33,18.34 73.89,20.78 73.89,21.31 U2.11
S6
  Bottom 0.152: U2.12 73.05,21.39 73.05,25.2 72.97,25.27 72.97,25.88 76.02,28.93 81.97,28.93 83.64,27.25 IR6.P$1
S7
  Bottom 0.152: U2.13 72.29,21.31 72.29,18.11 74.88,15.52 IR7.P$1
S8
  Bottom 0.152: U2.18 68.4,23.52 67.87,23.52 62.76,18.42 62.76,7.44 IR8.P$1
S9
  Bottom 0.152: U2.21 68.4,25.88 66.19,25.88 48.59,8.28 48.59,4.01 IR9.P$1
S10
  Bottom 0.152: U2.22 68.4,26.72 66.12,26.72 45.54,6.15 34.49,6.15 34.04,5.69 IR10.P$1
S12
  Bottom 0.152: U2.14 71.45,21.31 71.45,16.59 63.98,9.12 63.98,6.83 61.39,4.24 50.5,4.24 49.05,2.8 35.26,2.8 33.5,4.55 29.69,4.55 22.07,12.17 21.01,12.17 IR11.P$1
S13  (via drill 0.35)
  Top 0.152: v66.42,16.51 60.02,16.51 54.53,11.02 v45.16,11.02 | v24.59,11.25 19.94,11.25 10.95,20.24 10.95,22.76 IR12.P$1
  Bottom 0.152: v66.42,16.51 70.61,20.7 70.61,21.31 U2.15 | v45.16,11.02 44.55,11.02 42.72,9.2 30.45,9.2 28.4,11.25 v24.59,11.25
S14
  Bottom 0.152: U2.27 71.45,29.69 71.45,25.5 69.47,23.52 69.47,22.3 63.68,16.51 63.68,6.99 61.24,4.55 50.34,4.55 48.9,3.1 35.41,3.1 33.66,4.85 30.07,4.85 22.68,12.24 22.68,16.74 7.37,32.05 7.37,33.88 5.08,36.17 IR13.P$1
S15
  Bottom 0.152: U2.28 72.29,29.77 72.29,33.5 75.26,36.48 75.26,44.32 76.71,45.77 76.71,54.69 48.59,82.81 30.91,82.81 23.98,75.87 23.29,75.87 7.75,60.33 7.75,53.62 4.93,50.8 4.24,50.8 IR14.P$1
S16  (via drill 0.35)
  Top 0.152: v73.13,27.64 73.13,27.25 v74.5,25.88 | v74.35,22.68 70.61,18.95 v70.61,14.83 | v6.68,62.99 6.68,63.14 8.28,64.75 IR15.P$1
  Bottom 0.152: v73.13,27.64 73.13,29.69 U2.29 | v74.5,25.88 74.5,22.84 v74.35,22.68 | v70.61,14.83 64.29,8.51 64.29,6.68 61.55,3.94 50.65,3.94 49.2,2.49 35.1,2.49 33.35,4.24 29.54,4.24 22.53,11.25 19.94,11.25 6.6,24.59 6.6,32.74 3.25,36.09 3.25,59.56 v6.68,62.99
S17
  Bottom 0.152: U2.30 73.89,29.77 73.89,34.65 75.57,36.32 75.57,44.17 77.01,45.62 77.01,54.84 48.74,83.11 30.76,83.11 28.4,80.75 20.32,80.75 17.12,77.55 17.12,76.56 IR16.P$1
SWO
  Bottom 0.152: U2.26 70.69,29.77 70.69,32.36 74.96,36.63 74.96,44.48 76.4,45.92 76.4,50.5 75.49,51.41 SV2.6
TCK
  Bottom 0.152: U2.24 68.48,28.4 68.48,30.45 70.38,32.36 70.38,32.51 74.65,36.78 74.65,45.62 75.41,46.38 SV2.2
TMS  (via drill 0.35)
  Top 0.152: v70.84,28.17 75.34,32.66 75.34,33.27 74.88,33.73 74.65,33.73 73.97,34.42 73.97,34.72 75.95,36.7 80.67,36.7 80.98,37.01 80.98,37.77 79.91,38.84 73.81,38.84 73.58,39.07 73.58,45.85 v74.19,46.46
  Bottom 0.152: v70.84,28.17 70.23,27.56 U2.23 | v74.19,46.46 74.19,47.68 75.41,48.9 SV2.4
TX
  Bottom 0.152: U2.19 68.3,24.18 67.59,24.18 64.6,21.19 63.1,21.19 X2.3